# Altium schematic sheet Sheet1.SchDoc
size A4
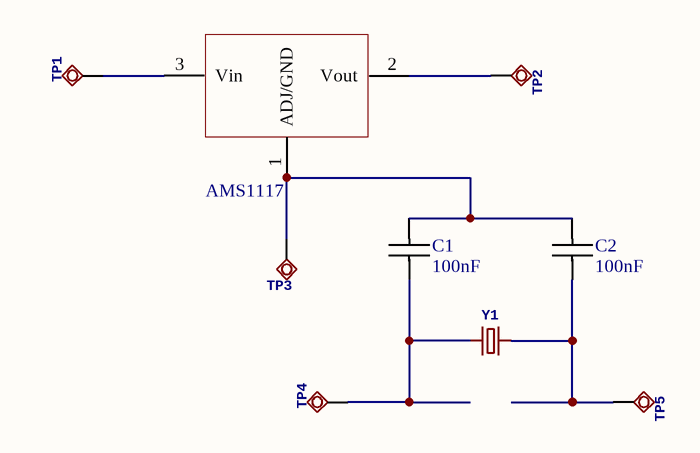
[diagram p0: Sheet1.SchDoc]

## Parts
AMS1117  AMS1117  [SOT-223-3]  (value not drawn)
C1  100nF  [C 0603 / 1608]
C2  100nF  [C 0603 / 1608]
TP1  Test pad  [TP20SQ]  (value not drawn)
TP2  Test pad  [TP20SQ]  (value not drawn)
TP3  Test pad  [TP20SQ]  (value not drawn)
TP4  Test pad  [TP20SQ]  (value not drawn)
TP5  Test pad  [TP20SQ]  (value not drawn)
Y1  Crystals (Generic)These are passive quartz crystals, which can be used as a clock source for a microcontroller.Crystal's are two-terminal devices. They require external "load" capacitors to generate an oscillating signal.  [HC49US]  (value not drawn)

## Nets
NetAMS1117_1: AMS1117.1(ADJ/GND) C1.1 C2.1 TP3.TP
NetAMS1117_2: AMS1117.2(Vout) TP2.TP
NetAMS1117_3: AMS1117.3(Vin) TP1.TP
NetC1_2: C1.2 TP4.TP Y1.1
NetC2_2: C2.2 TP5.TP Y1.2

## Library data of the parts
AMS1117 = AMS1117: LDO 3.3V/5V/12V
C1 C2 = Capacitor
TP1-TP5 = TPSQTP20SQ
Y1 = CRYSTALPTH-HC49US: GateName_1: G$1; SymbolName_1: CRYSTAL; DeviceName: PTH-HC49US; LibraryName: SparkFun-Clocks; DeviceSetName: CRYSTAL; Package: HC49US